# Altium schematic sheet mcu.SchDoc: DiPho digital
size 420 x 297 mm; Author: P. Daniel; CompanyName: WUT ISE; DrawnBy: P. Daniel; Organization: WUT ISE; Address1: WUT ISE; Address2: Nowowiejska 15/19 00-665 Warsaw; Address3: piotrmaciejdaniel@gmail.com; Revision: 1; SheetNumber: 2; SheetTotal: 4; ModifiedBy: -; CreateDate: 10-12.2021; CheckedDate: -; Title2: MCU and IO; DivGrp: WUT ISE; Designer: Piotr Daniel; ModifiedDate: -; ProjectName: Sensor Box
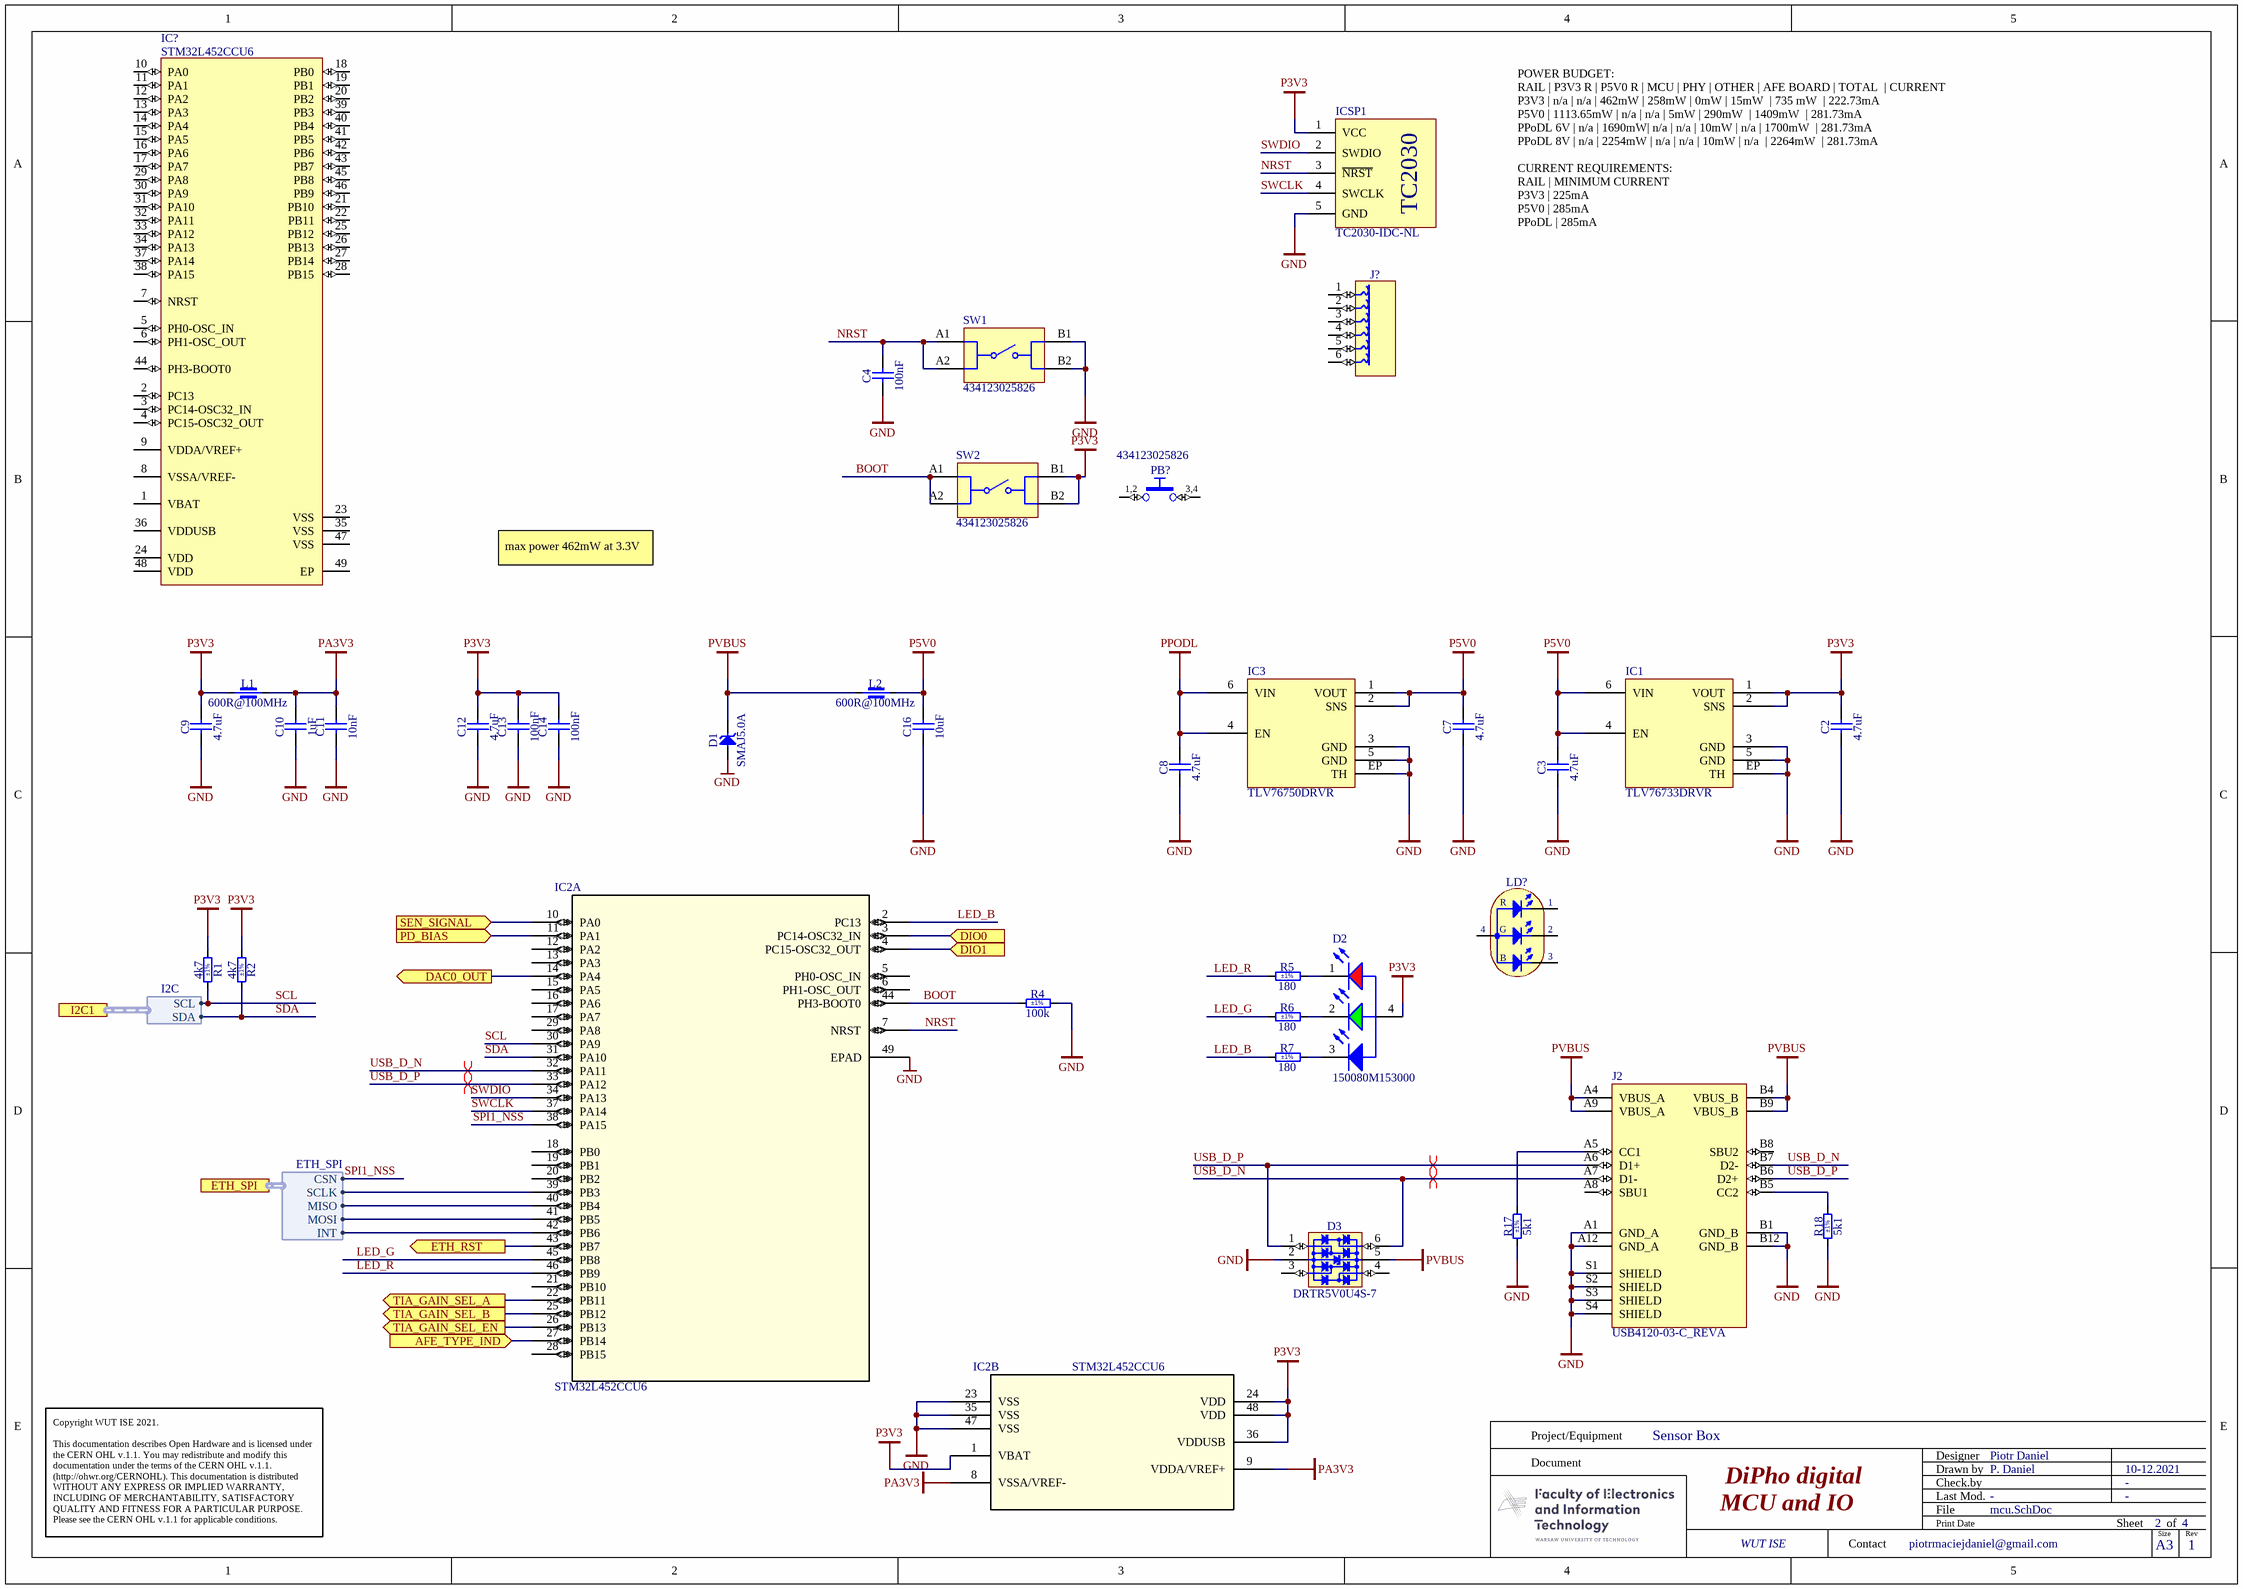
[diagram p0: mcu.SchDoc]

## Parts
C2  4.7uF  [CAPC1709X95N]
C3  4.7uF  [CAPC1709X95N]
C4  100nF  [CAPC1005X55N]
C7  4.7uF  [CAPC1709X95N]
C8  4.7uF  [CAPC1709X95N]
C9  4.7uF  [CAPC1709X95N]
C10  1uF  [CAPC1005X55N]
C11  10nF  [CAPC1005X55N]
C12  4.7uF  [CAPC1709X95N]
C13  100nF  [CAPC1005X55N]
C14  100nF  [CAPC1005X55N]
C16  10uF  [CAPC1608X80N]
D1  SMAJ5.0A  [DIOM5226X262N]
D2  150080M153000  [WL-SFCD_0805]
D3  DRTR5V0U4S-7  [SOT65P210X110-6N]
IC1  TLV76733DRVR  [SON65P200X80_HS-7N]
IC2  STM32L452CCU6  [UFQFPN48-7x7mm_STM-L]  (parts A,B of 2)
IC3  TLV76750DRVR  [SON65P200X80_HS-7N]
IC?  STM32L452CCU6  [QFN50P700X700X60-49N-S570]
ICSP1  TC2030-IDC-NL  [TC2030-IDC-NL]
J2  USB4120-03-C_REVA  [GCT_USB4120-03-C_REVA]
J?  TC2030-MCP  [TC2030-MCP-NL]  (value not drawn)
L1  600R@100MHz  [INDC1005X55N]
L2  600R@100MHz  [INDC1005X55N]
LD?  Red/Green/Blue  [LED_WURTH_150080M153000]  (value not drawn)
PB?  Manufacturer Part Number: 434123025826  [PB_WURTH_434123025826]  (hidden comment: Push Button)
R1  4k7  Tolerance: ±1%  [RESC1005X40N]
R2  4k7  Tolerance: ±1%  [RESC1005X40N]
R4  100k  Tolerance: ±1%  [RESC1005X40N]
R5  180  Tolerance: ±1%  [RESC1005X40N]
R6  180  Tolerance: ±1%  [RESC1005X40N]
R7  180  Tolerance: ±1%  [RESC1005X40N]
R17  5k1  Tolerance: ±1%  [RESC1005X40N]
R18  5k1  Tolerance: ±1%  [RESC1005X40N]
SW1  434123025826  [WS-TASV_L4.2W3.2H2.5_4341x30258x6]
SW2  434123025826  [WS-TASV_L4.2W3.2H2.5_4341x30258x6]

## Ports
AFE_TYPE_IND (in), DAC0_OUT (out), DIO0 (in), DIO1 (in), ETH_RST (out), ETH_SPI (harness ETH_SPI), I2C1 (harness I2C), PD_BIAS (in), SEN_SIGNAL (in), TIA_GAIN_SEL_A (out), TIA_GAIN_SEL_B (out), TIA_GAIN_SEL_EN (out)

## Harnesses
I2C: SCL, SDA
ETH_SPI: INT, SCLK, MISO, MOSI, CSN

## Nets
GND: C2.1 C3.1 C4.1 C7.1 C8.1 C9.1 C10.1 C11.1 C12.1 C13.1 C14.1 C16.1 D1.2(A) D3.2(GND) IC1.3(GND) IC1.5(GND) IC1.EP(TH) IC2.23(VSS) IC2.35(VSS) IC2.47(VSS) IC2.49(EPAD) IC3.3(GND) IC3.5(GND) IC3.EP(TH) ICSP1.5(GND) J2.A1(GND_A) J2.A12(GND_A) J2.B1(GND_B) J2.B12(GND_B) J2.S1(SHIELD) J2.S2(SHIELD) J2.S3(SHIELD) J2.S4(SHIELD) R4.2 R17.1 R18.1 SW1.B1 SW1.B2
P3V3: C2.2 C9.2 C12.2 C13.2 C14.2 D2.4(A) IC1.1(VOUT) IC1.2(SNS) IC2.1(VBAT) IC2.24(VDD) IC2.36(VDDUSB) IC2.48(VDD) ICSP1.1(VCC) L1.1 R1.2 R2.2 SW2.B1 SW2.B2
P5V0: C3.2 C7.2 C16.2 IC1.4(EN) IC1.6(VIN) IC3.1(VOUT) IC3.2(SNS) L2.2
PA3V3: C10.2 C11.2 IC2.8(VSSA/VREF-) IC2.9(VDDA/VREF+) L1.2
PPODL: C8.2 IC3.4(EN) IC3.6(VIN)
PVBUS: D1.1(C) D3.5(VBUS) J2.A4(VBUS_A) J2.A9(VBUS_A) J2.B4(VBUS_B) J2.B9(VBUS_B) L2.1
AFE_TYPE_IND: IC2.27(PB14) ; port AFE_TYPE_IND
BOOT: IC2.44(PH3-BOOT0) R4.1 SW2.A1 SW2.A2
DAC0_OUT: IC2.14(PA4) ; port DAC0_OUT
DIO0: IC2.3(PC14-OSC32_IN) ; port DIO0
DIO1: IC2.4(PC15-OSC32_OUT) ; port DIO1
ETH_RST: IC2.43(PB7) ; port ETH_RST
LED_B: IC2.2(PC13) R7.1
LED_G: IC2.45(PB8) R6.1
LED_R: IC2.46(PB9) R5.1
NRST: C4.2 IC2.7(NRST) ICSP1.3(~{NRST}) SW1.A1 SW1.A2
PD_BIAS: IC2.11(PA1) ; port PD_BIAS
SCL: IC2.30(PA9) R1.1 ; port I2C1.SCL
SDA: IC2.31(PA10) R2.1 ; port I2C1.SDA
SEN_SIGNAL: IC2.10(PA0) ; port SEN_SIGNAL
SPI1_NSS: IC2.38(PA15) ; port ETH_SPI.CSN
SWCLK: IC2.37(PA14) ICSP1.4(SWCLK)
SWDIO: IC2.34(PA13) ICSP1.2(SWDIO)
TIA_GAIN_SEL_A: IC2.22(PB11) ; port TIA_GAIN_SEL_A
TIA_GAIN_SEL_B: IC2.25(PB12) ; port TIA_GAIN_SEL_B
TIA_GAIN_SEL_EN: IC2.26(PB13) ; port TIA_GAIN_SEL_EN
USB_D_N: D3.6(I/O4) IC2.32(PA11) J2.A7(D1-) J2.B7(D2-)
USB_D_P: D3.1(I/O1) IC2.33(PA12) J2.A6(D1+) J2.B6(D2+)
NetD2_1: D2.1(K) R5.2
NetD2_2: D2.2(K) R6.2
NetD2_3: D2.3(K) R7.2
NetIC2_39: IC2.39(PB3) ; port ETH_SPI.SCLK
NetIC2_40: IC2.40(PB4) ; port ETH_SPI.MISO
NetIC2_41: IC2.41(PB5) ; port ETH_SPI.MOSI
NetIC2_42: IC2.42(PB6) ; port ETH_SPI.INT
NetJ2_A5: J2.A5(CC1) R17.2
NetJ2_B5: J2.B5(CC2) R18.2
NetPB?_1: PB?.1 PB?.2
NetPB?_3: PB?.3 PB?.4

Not connected (* = marked no-connect by the designer): D3 3(I/O2) 4(I/O3); IC2 5(PH0-OSC_IN) 6(PH1-OSC_OUT) 12(PA2) 13(PA3) 15(PA5) 16(PA6) 17(PA7) 18(PB0) 19(PB1) 20(PB2) 21(PB10) 28(PB15) 29(PA8); IC? 1(VBAT) 2(PC13) 3(PC14-OSC32_IN) 4(PC15-OSC32_OUT) 5(PH0-OSC_IN) 6(PH1-OSC_OUT) 7(NRST) 8(VSSA/VREF-) 9(VDDA/VREF+) 10(PA0) 11(PA1) 12(PA2) 13(PA3) 14(PA4) 15(PA5) 16(PA6) 17(PA7) 18(PB0) 19(PB1) 20(PB2) 21(PB10) 22(PB11) 23(VSS) 24(VDD) 25(PB12) 26(PB13) 27(PB14) 28(PB15) 29(PA8) 30(PA9) 31(PA10) 32(PA11) 33(PA12) 34(PA13) 35(VSS) 36(VDDUSB) 37(PA14) 38(PA15) 39(PB3) 40(PB4) 41(PB5) 42(PB6) 43(PB7) 44(PH3-BOOT0) 45(PB8) 46(PB9) 47(VSS) 48(VDD) 49(EP); J2 A8(SBU1) B8(SBU2); J? 1 2 3 4 5 6; LD? 1(CR) 2(CG) 3(CR) 4(AC)

## Layout directives
differential pair: USB_D_N, USB_D_P

## Notes on the sheet
- POWER BUDGET:
  RAIL	| P3V3 R	| P5V0 R	| MCU	| PHY	| OTHER	| AFE BOARD	| TOTAL		| CURRENT
  P3V3	| n/a	| n/a	| 462mW	| 258mW	| 0mW	| 15mW		| 735 mW		| 222.73mA
  P5V0	| 1113.65mW	| n/a	| n/a	| 5mW	| 290mW		| 1409mW		| 281.73mA
  PPoDL 6V	| n/a	| 1690mW| n/a	| n/a	| 10mW	| n/a	| 1700mW		| 281.73mA
  PPoDL 8V	| n/a	| 2254mW	| n/a	| n/a	| 10mW	| n/a		| 2264mW		| 281.73mA
  CURRENT REQUIREMENTS:
  RAIL	| MINIMUM CURRENT
  P3V3	| 225mA
  P5V0	| 285mA
  PPoDL	| 285mA
- max power 462mW at 3.3V
- Project/Equipment
- Document
- Designer
- Drawn by
- Check.by
- Copyright WUT ISE 2021.
  This documentation describes Open Hardware and is licensed under the CERN OHL v.1.1. You may redistribute and modify this documentation under the terms of the CERN OHL v.1.1. (http://ohwr.org/CERNOHL). This documentation is distributed WITHOUT ANY EXPRESS OR IMPLIED WARRANTY, INCLUDING OF MERCHANTABILITY, SATISFACTORY QUALITY AND FITNESS FOR A PARTICULAR PURPOSE. Please see the CERN OHL v.1.1 for applicable conditions.
- Contact
- File
- Last Mod.
- Print Date
- Sheet
- Size
- A3
- of
- Rev
- (in symbol LED_WURTH_150080M153000) R; G; B
- (in symbol PB_WURTH_434123025826) 1,2; 3,4
- (in symbol TC2030-IDC-NL) TC2030

## Library data of the parts
C2 C3 C7-C9 C12 = CC0603_4.7UF_16V_10%_X5R: Non-polarised capacitor; Part Description: SMD Multilayer Chip Ceramic Capacitor; Manufacturer: GENERIC; Manufacturer1 Part Number: EMK107ABJ475KA-T; Voltage: 16V; TC: X5R; Tolerance: ±10%; Part Number: CC0603_4.7UF_16V_10%_X5R; Component Kind: Standard; Component Type: Standard; Pin Count: 2; Value: 4.7uF; Status: None; Manufacturer Part Number: CC0603_4.7UF_16V_10%_X5R; Case: 0603; Mounted: Yes; Socket: No; SMD: Yes; Sense: No; Manufacturer1 Example: TAIYO YUDEN; Manufacturer1 ComponentHeight: 0.95mm; HelpURL: \\cern.ch\dfs\Applications\Altium\Datasheets\CC0603_X7R_TAIYO-YUDEN_HIGH-VALUE.pdf; Author: CERN DEM JLC; CreateDate: 16.12.2013; LatestRevisionDate: 16.09.2014
C4 C13 C14 = CC0402_100NF_16V_10%_X7R: Non-polarised capacitor; Part Description: SMD Multilayer Chip Ceramic Capacitor; Manufacturer: GENERIC; Manufacturer1 Part Number: GRM155R71C104KA88D; Voltage: 16V; TC: X7R; Tolerance: ±10%; Part Number: CC0402_100NF_16V_10%_X7R; Component Kind: Standard; Component Type: Standard; Pin Count: 2; Value: 100nF; Status: Not Recommended; Manufacturer Part Number: CC0402_100NF_16V_10%_X7R; Case: 0402; Mounted: Yes; Socket: No; SMD: Yes; Sense: No; Manufacturer1 Example: MURATA; Manufacturer1 ComponentHeight: 0.55mm; HelpURL: \\cern.ch\dfs\Applications\Altium\Datasheets\CC0402_X7R_MURATA_GRM.pdf; Author: CERN DEM JLC; CreateDate: 05.12.2013; LatestRevisionDate: 03.12.2007
C10 = CC0402_1UF_16V_10%_X5R: Non-polarised capacitor; Part Description: SMD Multilayer Chip Ceramic Capacitor; Manufacturer: GENERIC; Manufacturer1 Part Number: C1005X5R1C105KT; Voltage: 16V; TC: X5R; Tolerance: ±10%; Part Number: CC0402_1UF_16V_10%_X5R; Component Kind: Standard; Component Type: Standard; Pin Count: 2; Value: 1uF; Status: Preferred; Manufacturer Part Number: CC0402_1UF_16V_10%_X5R; Case: 0402; Mounted: Yes; Socket: No; SMD: Yes; Sense: No; Manufacturer1 Example: TDK; Manufacturer1 ComponentHeight: 0.55mm; HelpURL: \\cern.ch\dfs\Applications\Altium\Datasheets\CC0402_X5R_TDK_C.pdf; Author: CERN DEM JLC; CreateDate: 25.10.2012; LatestRevisionDate: 25.10.2012
C11 = CC0402_10NF_16V_10%_X7R: Non-polarised capacitor; Part Description: SMD Multilayer Chip Ceramic Capacitor; Manufacturer: GENERIC; Manufacturer1 Part Number: 223878715636; Voltage: 16V; TC: X7R; Tolerance: ±10%; Part Number: CC0402_10NF_16V_10%_X7R; Component Kind: Standard; Component Type: Standard; Pin Count: 2; Value: 10nF; Status: Not Recommended; Manufacturer Part Number: CC0402_10NF_16V_10%_X7R; Case: 0402; Mounted: Yes; Socket: No; SMD: Yes; Sense: No; Manufacturer1 Example: PHYCOMP; Manufacturer1 ComponentHeight: 0.55mm; HelpURL: \\cern.ch\dfs\Applications\Altium\Datasheets\CC0402_X7R_PHYCOMP.pdf; Author: CERN DEM JLC; CreateDate: 03.12.2007; LatestRevisionDate: 03.12.2007
C16 = CC0603_10UF_10V_10%_X5R: Non-polarised capacitor; Part Description: SMD Multilayer Chip Ceramic Capacitor; Manufacturer: GENERIC; Manufacturer1 Part Number: GRM188R61A106KE69D; Voltage: 10V; TC: X5R; Tolerance: ±10%; Part Number: CC0603_10UF_10V_10%_X5R; Component Kind: Standard; Component Type: Standard; Pin Count: 2; Value: 10uF; Status: None; Manufacturer Part Number: CC0603_10UF_10V_10%_X5R; Case: 0603; Mounted: Yes; Socket: No; SMD: Yes; Sense: No; Manufacturer1 Example: MURATA; Manufacturer1 ComponentHeight: 0.8mm; HelpURL: \\cern.ch\dfs\Applications\Altium\Datasheets\CC0603_MURATA_GRM188R61A106KE69D.pdf; Author: CERN DEM JLC; CreateDate: 31.01.2017; LatestRevisionDate: 31.01.2017
D1 = SMAJ5.0A: Transient Voltage Suppressor Diode (Uni-Directional); Part Description: Surface Mount Uni-directional Transient Voltage Suppressor Diode; Manufacturer: BOURNS; Voltage: 5V; Power: 400W; PressFit: No; Bonding: No; Part Number: SMAJ5.0A; Component Kind: Standard; Component Type: Standard; Device: SMAJ5.0A; PackageDescription: DO-214-AC/SMA Diode, Molded Body; 5.21mm L X 2.605mm W X 2.62mm H, IPC Medium Density; Manufacturer Part Number: SMAJ5.0A; Pin Count: 2; Case: DO-214AC; Mounted: Yes; Socket: No; SMD: Yes; Sense: No; ComponentHeight: 2.62mm; HelpURL: \\cern.ch\dfs\Applications\Altium\Datasheets\SMAJ5.0A.pdf; Author: CERN DEM MR; CreateDate: 14.07.2016; LatestRevisionDate: 14.07.2016
D2 = CMP-03913-82270974-1: 150080M153000 WL-SFCD SMT full-color Chip LED Diffused; Max Reverse Voltage (DC): 5V; Luminous Intensity: 70mcd; Forward Current: 60mA; Forward Voltage: 2V; Dominant Wavelength: 525nm; Power Dissipation: 48mW; Peak Wavelength: 468nm; Viewing Angle: 120°; RoHS: Non-Compliant; Width: 1.3mm; Length: 2mm; Packaging: Tape and Reel; NexarPartId: 82270974; Height: 500µm
D3 = D_TVS_DRTR5V0U4S-7: Integrated Quad Ultra-Low Capacitance ESD Protection; Part Description: Integrated Quad Ultra-Low Capacitance ESD (±8kV) Protection; Manufacturer: DIODES; PressFit: No; Bonding: No; Status Comment: Active; Part Number: DRTR5V0U4S-7; Component Kind: Standard; Component Type: Standard; Device: DRTR5V0U4S-7; PackageDescription: SOT363, SC70-6, 0.65mm Pitch; 6 Pin, 1.25mm W X 2.00mm L X 1.10mm H body, IPC Medium Density; Status: Active; Manufacturer Part Number: DRTR5V0U4S-7; Pin Count: 6; Case: SOT363; Mounted: Yes; Socket: No; SMD: Yes; Sense: No; ComponentHeight: 1.1mm; HelpURL: \\cern.ch\dfs\Applications\Altium\Datasheets\PRTR5V0U4Y.pdf; Author: GK; CreateDate: 24.01.2017; LatestRevisionDate: 14.09.2020
IC1 = TLV76733DRVR: Precision Linear Voltage Regulator Positive 3.3V 1A 6-Pin WSON T/R; Manufacturer: Texas Instruments; Manufacturer Part Number: TLV76733DRVR; RoHS: Yes; Category: Voltage Regulators - Linear; Stock 1: 13794; Pricing 1: 1=0,92000, 10=0,82200, 25=0,78040, 100=0,64120, 250=0,59936, 500=0,52968, 1000=0,42080 (USD); ComponentLink1URL: http://www.ti.com/general/docs/suppproductinfo.tsp?distId=10&amp;gotoUrl=http%3A%2F%2Fwww.ti.com%2Flit%2Fgpn%2Ftlv767&src-supplier=Digi-Key; ComponentLink1Description: http://www.ti.com/general/docs/suppproductinfo.tsp?distId=10&amp;gotoUrl=http%3A%2F%2Fwww.ti.com%2Flit%2Fgpn%2Ftlv767&src-supplier=Digi-Key
IC2 = UPC_STM32L452CCU6: No Description Available; Mfr_Name: STMicroelectronics; RefDes: RefDes; Type: Type
IC3 = TLV76750DRVR: Precision Linear Voltage Regulator Positive 5V 1A 6-Pin WSON T/R; Manufacturer: Texas Instruments; Supplier 1: Digi-Key; Manufacturer Part Number: TLV76750DRVR; RoHS: Yes; Category: Voltage Regulators - Linear; Stock 1: 13794; Pricing 1: 1=0,92000, 10=0,82200, 25=0,78040, 100=0,64120, 250=0,59936, 500=0,52968, 1000=0,42080 (USD); ComponentLink1URL: http://www.ti.com/general/docs/suppproductinfo.tsp?distId=10&amp;gotoUrl=http%3A%2F%2Fwww.ti.com%2Flit%2Fgpn%2Ftlv767&src-supplier=Digi-Key; ComponentLink1Description: http://www.ti.com/general/docs/suppproductinfo.tsp?distId=10&amp;gotoUrl=http%3A%2F%2Fwww.ti.com%2Flit%2Fgpn%2Ftlv767&src-supplier=Digi-Key; Supplier Part Number 1: 296-TLV76750DRVRCT-ND
IC? = STM32L452CCU6: Ultra-low-power Arm® Cortex®-M4 32-bit MCU+FPU, 100DMIPS, up to 512KB Flash, 160KB SRAM, analog, audio, ext. SMPS; Manufacturer: ST MICROELECTRONICS; PressFit: No; Bonding: No; Part Number: STM32L452CCU6; Component Kind: Standard; Component Type: Standard; Device: STM32L452CCU6; PackageDescription: QFN, 0.50mm Pitch, Square; 48 Pin, 7.00mm L X 7.00mm W X 0.60mm H body (w/Thermal Tab 5.7 X 5.7mm), IPC Medium Density; Part Description: Ultra-low-power Arm® Cortex®-M4 32-bit MCU+FPU, 100DMIPS, up to 512KB Flash, 160KB SRAM, analog, audio, ext. SMPS; Manufacturer Part Number: STM32L452CCU6; Pin Count: 49; Case: QFN48; Mounted: Yes; Socket: No; SMD: Yes; Sense: No; ComponentHeight: 0.6mm; HelpURL: \\cern.ch\dfs\Applications\Altium\Datasheets\STM32L452.pdf; Author: CERN DEM HF; CreateDate: 13.02.2025; LatestRevisionDate: 13.02.2025
ICSP1 = TC2030-IDC-NL: Tag-Connect 6-Pin with No Legs
J? = TC2030-MCP-NL: TC2030-MCP and TC2030-MCP-NL Pad Contact; Part Description: 6 X 31mil Diameter SMD Pad For TC2030-MCP No Leg Connector; Mounted: No; Part Number: TC2030-MCP-NL; Component Kind: Standard (No BOM); Component Type: Standard (No BOM); Pin Count: 6; Family: TC2030-MCP; Socket: No; SMD: Yes; Sense: No; Status: None; ComponentHeight: 0mm; HelpURL: \\cern.ch\dfs\Applications\Altium\Datasheets\TC2030-MCP-NL.pdf; Author: CERN DEM HF; CreateDate: 27.03.2023; LatestRevisionDate: 27.03.2023; PackageDescription: 6 X 31mil Diameter SMD Pad For TC2030-MCP No Leg Connector
L1 L2 = IND0402_MURATA_BLM15HD601SN1: Part Description: SMD EMIFIL Suppression Chip Ferrite Bead; Manufacturer: MURATA; Manufacturer Part Number: BLM15HD601SN1D; Power: 300mA; Resistance: 0.85R; Tolerance: ±25%; Part Number: IND0402_MURATA_BLM15HD601SN1; Component Kind: Standard; Component Type: Standard; Pin Count: 2; Value: 600R@100MHz; Status: None; Case: 0402; Mounted: Yes; Socket: No; SMD: Yes; Sense: No; ComponentHeight: 0.55mm; HelpURL: \\cern.ch\dfs\Applications\Altium\Datasheets\IND0402_MURATA_BLM15H.pdf; Author: CERN DEM JLC; CreateDate: 28.02.2012; LatestRevisionDate: 25.10.2018
LD? = LED_WURTH_150080M153000: Tricolor LEDs 1 Common Anode, 2 Cathode Red, 3 Cathode Green, 4 Cathode Blue; Part Description: Tri-Color (Red/Green/Blue), Body 2.0mm X 1.3mm X 0.5mm; Manufacturer: WURTH ELEKTRONIK; PressFit: No; Bonding: No; Part Number: LED_WURTH_150080M153000; Component Kind: Standard; Component Type: Standard; Color: Red/Green/Blue; PackageDescription: Tri-Color (Red/Green/Blue), Body 2.0mm X 1.3mm X 0.5mm; Manufacturer Part Number: 150080M153000; Pin Count: 4; Mounted: Yes; Socket: No; SMD: Yes; Sense: No; ComponentHeight: 0.5mm; HelpURL: \\cern.ch\dfs\Applications\Altium\Datasheets\LED_WURTH_150080M153000.pdf; Author: CERN DEM HF; CreateDate: 14.02.2025; LatestRevisionDate: 14.02.2025
PB? = PB_WURTH_434123025826: Push-Button Switch SPST; Part Description: Tactile Switch SPST-NO Top Actuated Surface Mount; Manufacturer: WURTH; PressFit: No; Part Number: PB_WURTH_434123025826; Component Kind: Standard; Component Type: Standard; Pin Count: 4; PackageDescription: Body L 4.6mm x W 3.2mm x H 2.7mm - Tactil Switch; Family: Push Button; Mounted: Yes; Socket: No; SMD: No; Sense: No; Status: None; ComponentHeight: 2.7mm; HelpURL: \\cern.ch\dfs\Applications\Altium\Datasheets\PB_WURTH_434123025826.pdf; Author: CERN DEM HF; CreateDate: 13.02.2025; LatestRevisionDate: 13.02.2025
R1 R2 = R0402_4K7_1%_0.0625W_100PPM: Resistor - 1%; Part Description: General Purpose Thick Film Chip Resistor; Manufacturer: GENERIC; Manufacturer1 Part Number: 232270674702L; TC: ±100ppm/°C; PressFit: No; Part Number: R0402_4K7_1%_0.0625W_100PPM; Component Kind: Standard; Component Type: Standard; Pin Count: 2; Value: 4k7; Status: Not Recommended; Power: 0.0625W; Manufacturer Part Number: R0402_4K7_1%_0.0625W_100PPM; Case: 0402; Mounted: Yes; Sense: No; Socket: No; SMD: Yes; Manufacturer1 Example: YAGEO PHYCOMP; Manufacturer1 ComponentHeight: 0.4mm; HelpURL: \\cern.ch\dfs\Applications\Altium\Datasheets\R0402_Phycomp_RC0402.pdf; Author: CERN DEM JLC; CreateDate: 03.12.2007; LatestRevisionDate: 17.10.2012
R4 = R0402_100K_1%_0.0625W_100PPM: Resistor - 1%; Part Description: General Purpose Thick Film Chip Resistor; Manufacturer: GENERIC; Manufacturer1 Part Number: 232270671004L; TC: ±100ppm/°C; PressFit: No; Part Number: R0402_100K_1%_0.0625W_100PPM; Component Kind: Standard; Component Type: Standard; Pin Count: 2; Value: 100k; Status: Not Recommended; Power: 0.0625W; Manufacturer Part Number: R0402_100K_1%_0.0625W_100PPM; Case: 0402; Mounted: Yes; Sense: No; Socket: No; SMD: Yes; Manufacturer1 Example: YAGEO PHYCOMP; Manufacturer1 ComponentHeight: 0.4mm; HelpURL: \\cern.ch\dfs\Applications\Altium\Datasheets\R0402_Phycomp_RC0402.pdf; Author: CERN DEM JLC; CreateDate: 03.12.2007; LatestRevisionDate: 17.10.2012
R5-R7 = R0402_180R_1%_0.0625W_100PPM: Resistor - 1%; Part Description: General Purpose Thick Film Chip Resistor; Manufacturer: GENERIC; Manufacturer1 Part Number: 232270671801L; TC: ±100ppm/°C; PressFit: No; Part Number: R0402_180R_1%_0.0625W_100PPM; Component Kind: Standard; Component Type: Standard; Pin Count: 2; Value: 180; Status: Not Recommended; Power: 0.0625W; Manufacturer Part Number: R0402_180R_1%_0.0625W_100PPM; Case: 0402; Mounted: Yes; Sense: No; Socket: No; SMD: Yes; Manufacturer1 Example: YAGEO PHYCOMP; Manufacturer1 ComponentHeight: 0.4mm; HelpURL: \\cern.ch\dfs\Applications\Altium\Datasheets\R0402_Phycomp_RC0402.pdf; Author: CERN DEM JLC; CreateDate: 03.12.2007; LatestRevisionDate: 17.10.2012
R17 R18 = R0402_5K1_1%_0.0625W_100PPM: Resistor - 1%; Part Description: General Purpose Thick Film Chip Resistor; Manufacturer: GENERIC; Manufacturer1 Part Number: 232270675102L; TC: ±100ppm/°C; PressFit: No; Part Number: R0402_5K1_1%_0.0625W_100PPM; Component Kind: Standard; Component Type: Standard; Pin Count: 2; Value: 5k1; Status: Not Recommended; Power: 0.0625W; Manufacturer Part Number: R0402_5K1_1%_0.0625W_100PPM; Case: 0402; Mounted: Yes; Sense: No; Socket: No; SMD: Yes; Manufacturer1 Example: YAGEO PHYCOMP; Manufacturer1 ComponentHeight: 0.4mm; HelpURL: \\cern.ch\dfs\Applications\Altium\Datasheets\R0402_Phycomp_RC0402.pdf; Author: CERN DEM JLC; CreateDate: 03.12.2007; LatestRevisionDate: 17.10.2012
SW1 SW2 = CMP-03913-99472341-1: 434123025826 Tactile Switch, 0.05A, 16Vdc, 260Gf, Smd Rohs Compliant: Yes; Insulation Resistance: 100MΩ; Voltage Rating: 16V; Current Rating: 50mA; Max Operating Temperature: 85°C; NexarPartId: 99472341; Height: 2.5mm; Contact Plating: Silver; Min Operating Temperature: -40°C; Packaging: Tape and Reel; RoHS: Compliant
J2 = USB4120-03-C_REVA: Package: None; MP: USB4120-03-C_REVA; Value: *; Availability: Unavailable; Price: None